# Altium project 200222 Discharge Module R1.PrjPcb (part 2 of 2)
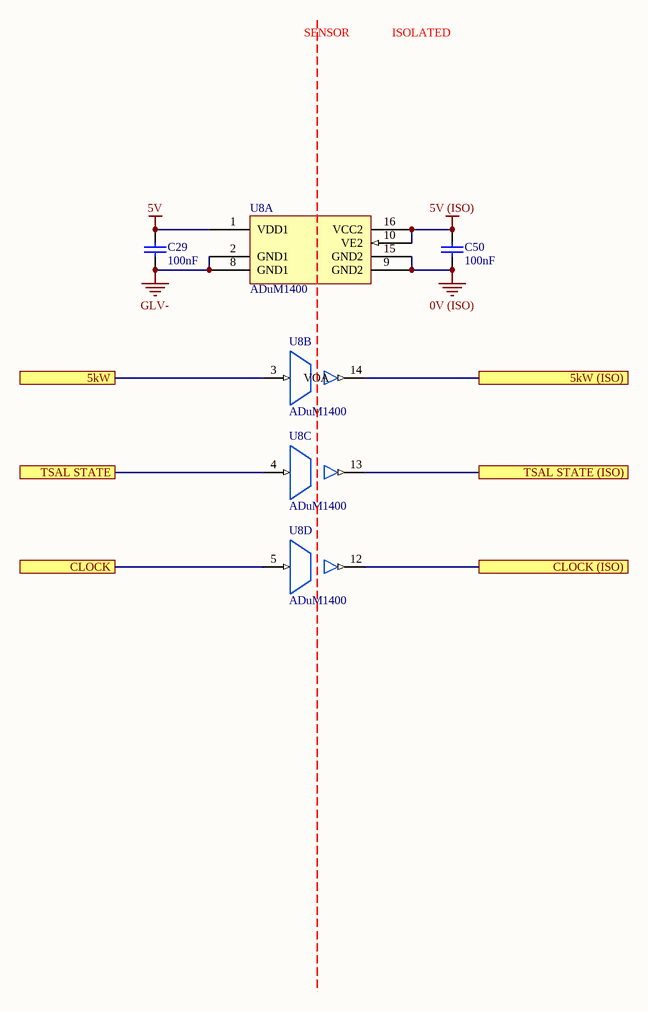
[diagram p11: DIgital Isolation.SchDoc]

## Nets that join several sheets
0V (ISO): CAN (9 pins), Power Supply (3.1 C31.1 R26.1 U9.16), Safety Loops (Q2.S R29.1 R32.1), Microcontroller (33 pins), Discharge (Q1.S U5.3), PDOC (10 pins), HV Sense (9 pins), DIgital Isolation (C50#2.1 U8#2.9 U8#2.15)
5V: Top Level (P3.1), Power Supply (1.1 C28.2 D7.A U8#1.3), Discharge (R6.2), 5kW Sensor (7 pins), HV Sense (R57.2), TSAL (7 pins), DIgital Isolation (C29#2.2 U8#2.1)
5V (ISO): CAN (6 pins), Power Supply (2.1 C31.2 D8.A U9.14), Safety Loops (5 pins), Microcontroller (8 pins), Discharge (D1.K R4.2 R7.2 U4.2), PDOC (7 pins), HV Sense (6 pins), DIgital Isolation (C50#2.2 U8#2.10 U8#2.16)
GLV-: Top Level (P2.11 P3.3), Power Supply (5 pins), Safety Loops (U10.2 U11.2), 5kW Sensor (8 pins), HV Sense (U17.3), TSAL (6 pins), DIgital Isolation (C29#2.1 U8#2.2 U8#2.8)
HV MC-: Top Level (HV_MC-1.1 HV_MC-1.2 R36.2), Discharge (R5.2), PDOC (17 pins), HV Sense (12 pins)
VDDISO: PDOC (16 pins), HV Sense (12 pins)
5kW: Top Level (P2.8), 5kW Sensor (4.1 R42.2), DIgital Isolation (U8#2.3)
5kW (ISO): Microcontroller (U6.30), DIgital Isolation (U8#2.14)
CAN1H: Top Level (P2.5), CAN (C11.2 CAN_TERM_R1.2 U2.1)
CAN1L: Top Level (P2.4), CAN (C10.2 CAN_TERM_R2.1 U2.2)
CAN RX: CAN (CAN_RX_TP1.1 U1.4), Microcontroller (U6.45)
CAN TX: CAN (CAN_TX_TP1.1 U1.5), Microcontroller (U6.46)
CANS: Top Level (P2.1), CAN (15 pins)
CLOCK (ISO): Microcontroller (U6.29), DIgital Isolation (U8#2.12)
Current Sensor: Top Level (P3.2), 5kW Sensor (R46.1)
Discharge Disable: Top Level (P3.12), Discharge (DIS_SIG_TP1.1 U5.2)
Discharge Disable (ISO): Microcontroller (U6.22), Discharge (DIS_SIG_ISO_TP1.1 R7.1 R8.1 U5.4)
GLV+: Top Level (P2.12 P3.7), Power Supply (F1.1 GLV+_TP1.1)
Green In: Top Level (P2.10 P3.5), Safety Loops (HVD_Bypass1.2 R27.2)
Green Out: Top Level (P2.9), Safety Loops (K1.13 PDOC_Bypass1.1)
HV MC+: Top Level (HV_MC+1.1 HV_MC+1.2 R35.2), Discharge (R3.1), HV Sense (R47.2)
HVD In: Top Level (P3.6), Safety Loops (HVD_Bypass1.1 K1.9 PDOC_Bypass1.2 R30.2)
HVD OK (ISO): Safety Loops (R31.2), Microcontroller (U6.26)
PDOC OK (ISO): Safety Loops (R34.1), Microcontroller (U6.28), PDOC (R62.1 U19.4)
SCL: Microcontroller (R16.1 U6.42), PDOC (U22.2), HV Sense (U16.2)
SDA: Microcontroller (R17.1 U6.43), PDOC (U22.3), HV Sense (U16.3)
SDN OK (ISO): Safety Loops (R28.2), Microcontroller (U6.27)
TSAL STATE (ISO): Microcontroller (U6.31), DIgital Isolation (U8#2.13)